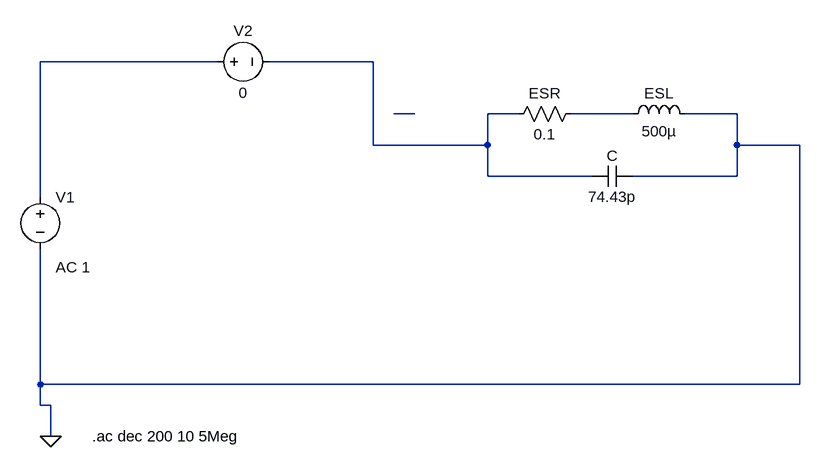
[diagram p0: schematic modelo_ind.asc]
modelo_ind.asc, the LTspice schematic file:
Version 4
SHEET 1 964 680
WIRE 64 16 -208 16
WIRE 304 16 144 16
WIRE 368 96 336 96
WIRE 528 96 480 96
WIRE 704 96 608 96
WIRE 864 96 784 96
WIRE 304 144 304 16
WIRE 480 144 480 96
WIRE 480 144 304 144
WIRE 864 144 864 96
WIRE 960 144 864 144
WIRE 480 192 480 144
WIRE 640 192 480 192
WIRE 864 192 864 144
WIRE 864 192 704 192
WIRE -208 224 -208 16
WIRE -208 512 -208 304
WIRE 960 512 960 144
WIRE 960 512 -208 512
WIRE -208 544 -208 512
WIRE -192 544 -208 544
WIRE -192 592 -192 544
FLAG -192 592 0
SYMBOL res 512 112 R270
WINDOW 0 32 56 VTop 2
WINDOW 3 0 56 VBottom 2
SYMATTR InstName ESR
SYMATTR Value 0.1
SYMBOL ind 688 112 R270
WINDOW 0 32 56 VTop 2
WINDOW 3 5 56 VBottom 2
SYMATTR InstName ESL
SYMATTR Value 500µ
SYMATTR SpiceLine Rser=0
SYMBOL cap 640 208 R270
WINDOW 0 32 32 VTop 2
WINDOW 3 0 32 VBottom 2
SYMATTR InstName C
SYMATTR Value 74.43p
SYMBOL voltage -208 208 R0
WINDOW 123 24 124 Left 2
WINDOW 39 0 0 Left 0
SYMATTR InstName V1
SYMATTR Value ""
SYMATTR Value2 AC 1
SYMBOL voltage 48 16 R270
WINDOW 0 32 56 VTop 2
WINDOW 3 -32 56 VBottom 2
WINDOW 123 0 0 Left 0
WINDOW 39 0 0 Left 0
SYMATTR InstName V2
SYMATTR Value 0
TEXT -128 592 Left 2 !.ac dec 200 10 5Meg

The netlist it stands for:
* modelo_ind.asc
R§ESR N002 N004 0.1
L§ESL N004 0 500µ Rser=0
C N002 0 74.43p
V1 N001 0 AC 1
V2 N001 N002 0
.ac dec 200 10 5Meg
.backanno
.end